# EAGLE design wurfel (EAGLE 7.5.0)
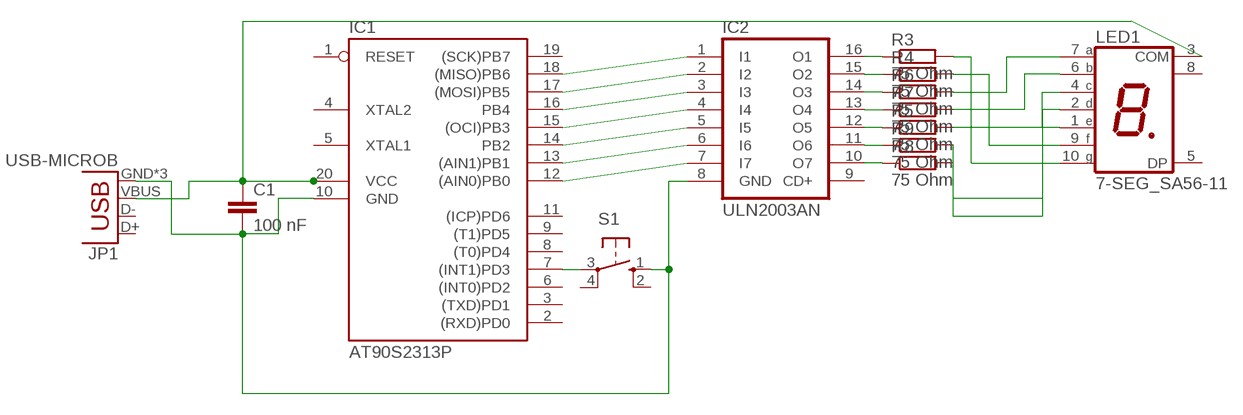
[diagram p0: schematic, sheet 1]

## Parts
C1  100 nF  C-EU050-025X075  [C050-025X075]
IC1  AT90S2313P  [DIL20]
IC2  ULN2003AN  [DIL16]
JP1  USB-MICROB  [USB-MICROB]
LED1  7-SEG_SA56-11  [SA56-11]
R3  75 Ohm  R-EU_0207/10  [0207/10]
R4  75 Ohm  R-EU_0207/10  [0207/10]
R5  75 Ohm  R-EU_0207/10  [0207/10]
R6  75 Ohm  R-EU_0207/10  [0207/10]
R7  75 Ohm  R-EU_0207/10  [0207/10]
R8  75 Ohm  R-EU_0207/10  [0207/10]
R9  75 Ohm  R-EU_0207/10  [0207/10]
S1  10-XX  [B3F-10XX]

## Nets
GND: C1.2 IC1.10(GND) IC2.8(GND) JP1.GND JP1.MT1(GND) JP1.MT2(GND) S1.1(S)
N$1: IC1.12((AIN0)PB0) IC2.7(I7)
N$2: IC1.13((AIN1)PB1) IC2.6(I6)
N$3: IC1.14(PB2) IC2.5(I5)
N$4: IC1.15((OCI)PB3) IC2.4(I4)
N$5: IC1.16(PB4) IC2.3(I3)
N$6: IC1.17((MOSI)PB5) IC2.2(I2)
N$7: IC1.18((MISO)PB6) IC2.1(I1)
N$8: IC1.7((INT1)PD3) S1.3(P)
N$9: LED1.10(G) R3.2
N$10: IC2.16(O1) R3.1
N$11: IC2.15(O2) R4.1
N$12: IC2.14(O3) R6.1
N$13: IC2.13(O4) R7.1
N$14: IC2.12(O5) R5.1
N$15: IC2.11(O6) R9.1
N$16: IC2.10(O7) R8.1
N$17: LED1.9(F) R4.2
N$18: LED1.7(A) R6.2
N$19: LED1.6(B) R7.2
N$20: LED1.4(C) R5.2
N$21: LED1.1(E) R8.2
N$22: LED1.2(D) R9.2
VCC: C1.1 IC1.20(VCC) JP1.VBUS LED1.3(COM)
Unconnected: IC1.1(RESET) IC1.2((RXD)PD0) IC1.3((TXD)PD1) IC1.4(XTAL2) IC1.5(XTAL1) IC1.6((INT0)PD2) IC1.8((T0)PD4) IC1.9((T1)PD5) IC1.11((ICP)PD6) IC1.19((SCK)PB7) IC2.9(CD+) JP1.D+ JP1.D- LED1.5(DP) LED1.8(COM) S1.2(S1) S1.4(P1)

## Library data of the parts
C1 = rcl:C-EU: CAPACITOR, European symbol
IC1 = atmel:AT90S2313: MICROCONTROLLER 2 Kbytes FLASH 128 bytes SRAM 128 bytes EEPROM UART; OC_FARNELL: unknown; OC_NEWARK: unknown
IC2 = uln-udn:ULN2003A: DRIVER ARRAY
JP1 = SparkFun-Connectors:USB: USB Connectors USB-B-PTH is fully proven SKU : PRT-00139/CONN-08278 USB-miniB is fully proven SKU : PRT-00587 USB-A-PCB is untested. USB-A-H is throughly reviewed, but untested. Spark Fun Electronics SKU : PRT-00437 USB-B-SMT is throughly reviewed, but untested. Needs silkscreen touching up. USB-A-S has not been used/tested USB-MB-H has not been used/tested USB-MICROB has been used. CONN-09505; PROD_ID: CONN-09505
LED1 = display-kingbright:7-SEG_: Kingbright 14.2mm (0.56 INCH) SINGLE DIGIT NUMERIC DUISPLAY Source: SA56-11EWA(Ver1189471036.pdf; OC_FARNELL: unknown; OC_NEWARK: unknown
R3-R9 = rcl:R-EU_: RESISTOR, European symbol
S1 = switch-omron:10-XX: OMRON SWITCH; MPN: B3F-1000; OC_FARNELL: 176432; OC_NEWARK: 36M3542

## Board
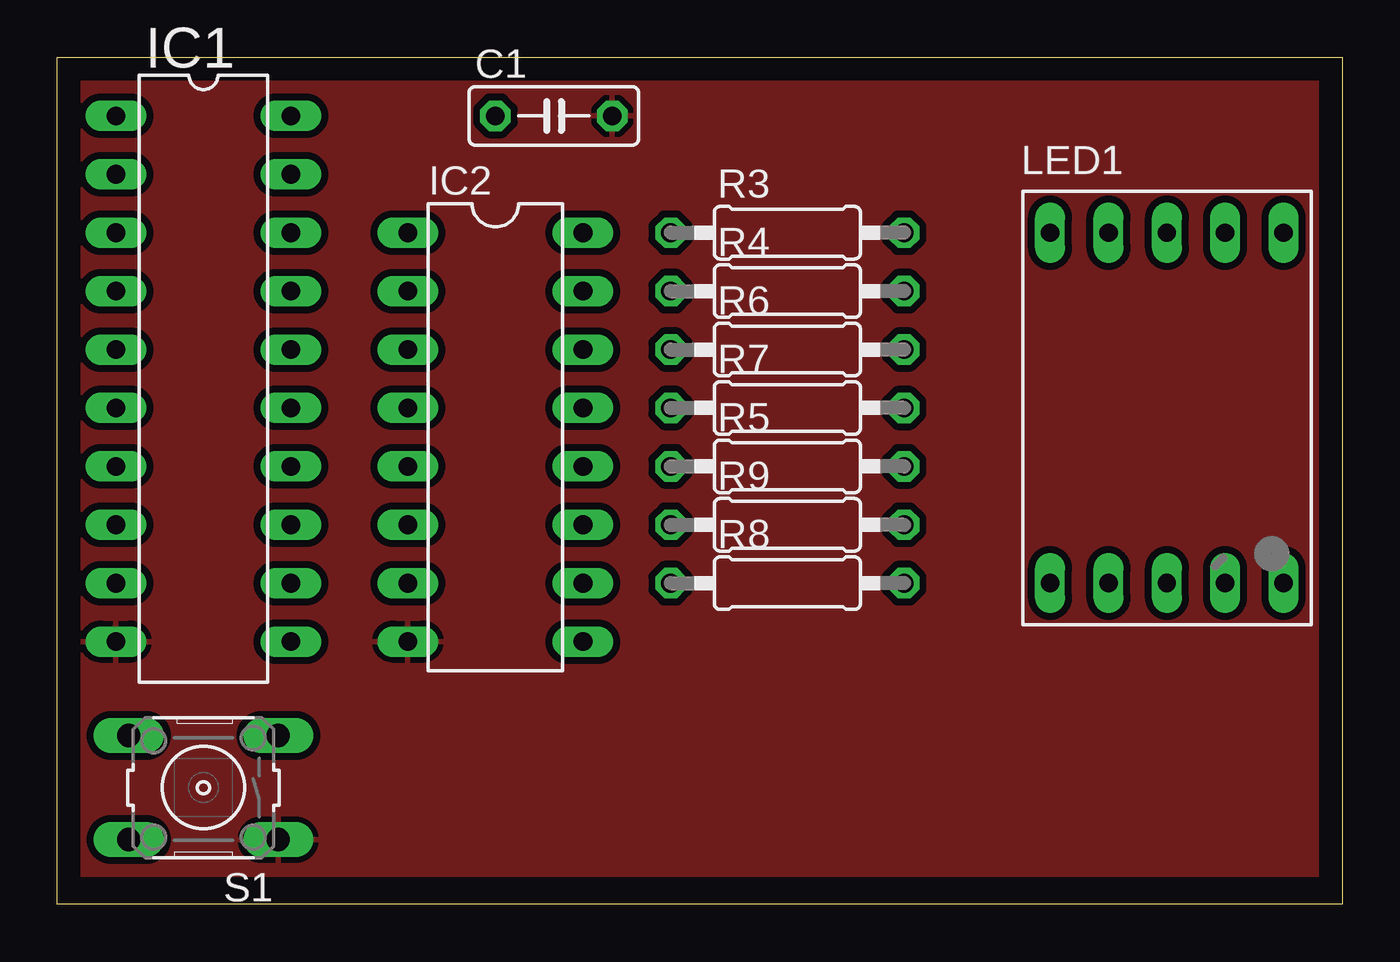
[diagram p1: board, top side]
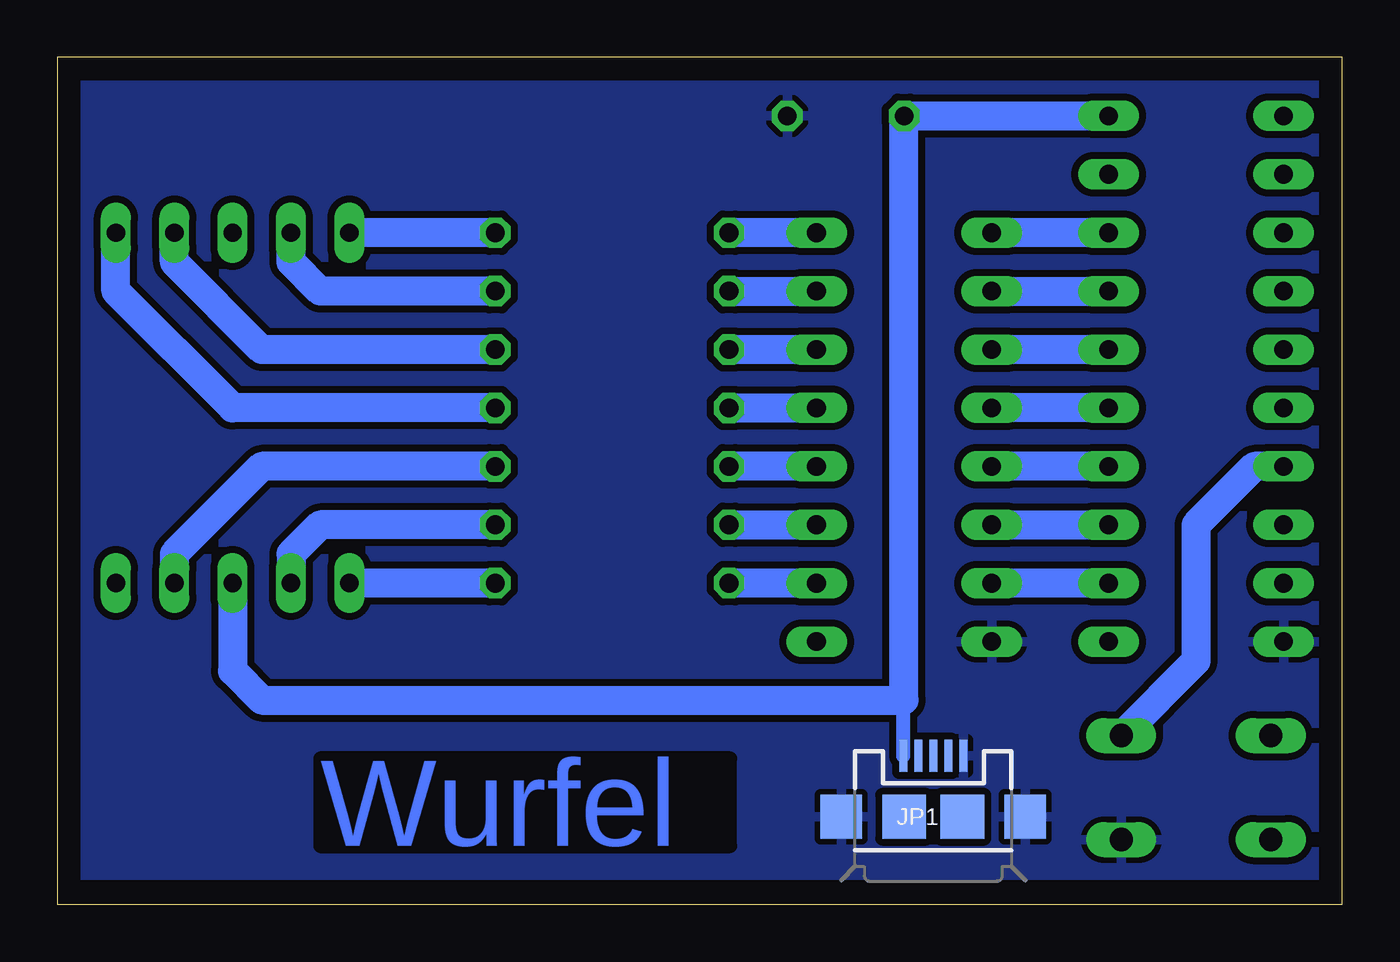
[diagram p2: board, bottom side, seen from below]

Size 55.88 x 36.83 mm. Coordinates in mm from the lower left corner, seen from the top.
Outline: 0,36.83 55.88,36.83 55.88,0 0,0 0,36.83
Copper layers (1*16): Top 0.035mm / dielectric 1.5mm / Bottom 0.035mm
Design rules "default *": minimum track width 10mil, minimum drill 24mil, track to track 12mil, track to pad 12mil, pad to pad 12mil, via to via 12mil, smd to smd 12mil, copper to edge 40mil, drill to drill 10mil, minimum pad ring 10mil, minimum via ring 8mil, stop-mask expansion 4mil, vias tented up to drill 0mil, thermal gap 10mil

### Footprints (pad centres in the part's own frame; a part is rotated, then mirrored left to right if it is on the bottom)
C050-025X075 = drill 0.813 octagon: 1 -2.54,0; 2 2.54,0
DIL20 = drill 0.813 long: 1 -11.43,-3.81; 2 -8.89,-3.81; 3 -6.35,-3.81; 4 -3.81,-3.81; 5 -1.27,-3.81; 6 1.27,-3.81; 7 3.81,-3.81; 8 6.35,-3.81; 9 8.89,-3.81; 10 11.43,-3.81; 11 11.43,3.81; 12 8.89,3.81; 13 6.35,3.81; 14 3.81,3.81; 15 1.27,3.81; 16 -1.27,3.81; 17 -3.81,3.81; 18 -6.35,3.81; 19 -8.89,3.81; 20 -11.43,3.81
DIL16 = drill 0.813 long: 1 -8.89,-3.81; 2 -6.35,-3.81; 3 -3.81,-3.81; 4 -1.27,-3.81; 5 1.27,-3.81; 6 3.81,-3.81; 7 6.35,-3.81; 8 8.89,-3.81; 9 8.89,3.81; 10 6.35,3.81; 11 3.81,3.81; 12 1.27,3.81; 13 -1.27,3.81; 14 -3.81,3.81; 15 -6.35,3.81; 16 -8.89,3.81
USB-MICROB = smd 0.35 x 1.4: D+ 0,2.65; D- -0.65,2.65; GND 1.3,2.65; ID 0.65,2.65; VBUS -1.3,2.65 | smd 1.8 x 1.9: MT1 -4,0; MT2 4,0 | smd 1.9 x 1.9: P$1 -1.27,0; P$2 1.27,0
SA56-11 = drill 0.8 long: 1 -5.08,-7.62; 2 -2.54,-7.62; 3 0,-7.62; 4 2.54,-7.62; 5 5.08,-7.62; 6 5.08,7.62; 7 2.54,7.62; 8 0,7.62; 9 -2.54,7.62; 10 -5.08,7.62
0207/10 = drill 0.813 octagon: 1 -5.08,0; 2 5.08,0
B3F-10XX = drill 1.016 long: 1 -3.251,2.261; 2 3.251,2.261; 3 -3.251,-2.261; 4 3.251,-2.261

### Placement (x,y rotation side)
C1  21.59,34.29 0 top
IC1  6.35,22.86 270 top
IC2  19.05,20.32 270 top
JP1  17.78,3.81 0 bottom
LED1  48.26,21.59 0 top
R3  31.75,29.21 0 top
R4  31.75,26.67 0 top
R5  31.75,19.05 0 top
R6  31.75,24.13 0 top
R7  31.75,21.59 0 top
R8  31.75,13.97 0 top
R9  31.75,16.51 0 top
S1  6.35,5.08 180 top

### Tracks (layer width: path | path; a pad name or v marks a point on that pad's centre or on a via)
GND
  pour Bottom: -3.81,38.1 55.88,38.1 55.88,1.27 -3.81,1.27
  pour Top: -1.27,38.1 55.88,38.1 55.88,1.27 -1.27,1.27
N$1
  Bottom 1.27: IC1.12 IC2.7
N$2
  Bottom 1.27: IC2.6 IC1.13
N$3
  Bottom 1.27: IC1.14 IC2.5
N$4
  Bottom 1.27: IC1.15 IC2.4
N$5
  Bottom 1.27: IC1.16 IC2.3
N$6
  Bottom 1.27: IC2.2 IC1.17
N$7
  Bottom 1.27: IC1.18 IC2.1
N$8
  Bottom 1.27: IC1.7 3.81,19.05 6.35,16.51 6.35,10.59 S1.3
N$9
  Bottom 1.27: R3.2 LED1.10
N$10
  Bottom 1.27: IC2.16 R3.1
N$11
  Bottom 1.27: R4.1 IC2.15
N$12
  Bottom 1.27: IC2.14 R6.1
N$13
  Bottom 1.27: R7.1 IC2.13
N$14
  Bottom 1.27: IC2.12 R5.1
N$15
  Bottom 1.27: R9.1 IC2.11
N$16
  Bottom 1.27: IC2.10 R8.1
N$17
  Bottom 1.27: R4.2 44.45,26.67 45.72,27.94 LED1.9
N$18
  Bottom 1.27: R6.2 46.99,24.13 50.8,27.94 LED1.7
N$19
  Bottom 1.27: R7.2 48.26,21.59 53.34,26.67 LED1.6
N$20
  Bottom 1.27: R5.2 46.99,19.05 50.8,15.24 LED1.4
N$21
  Bottom 1.27: R8.2 LED1.1
N$22
  Bottom 1.27: R9.2 44.45,16.51 45.72,15.24 LED1.2
VCC
  Bottom 0.61: JP1.VBUS 19.08,8.86 19.05,8.89
  Bottom 1.27: IC1.20 C1.1 19.05,8.89 46.99,8.89 48.26,10.16 LED1.3

### Text on the board
Bottom: Wurfel